# Altium schematic sheet DRV8323.SchDoc
size A4
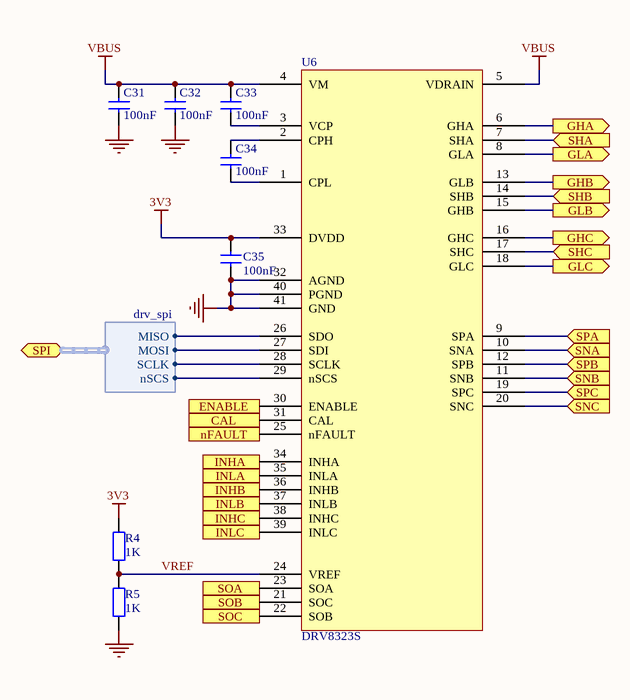
[diagram p0: DRV8323.SchDoc]

## Parts
C31  100nF  [CAP0402(1005)_N]
C32  100nF  [CAP0402(1005)_N]
C33  100nF  [CAP0402(1005)_N]
C34  100nF  [CAP0402(1005)_N]
C35  100nF  [CAP0402(1005)_N]
R4  1K  [RESC0402(1005)_N]
R5  1K  [RESC0402(1005)_N]
U6  DRV8323S  [WQFN-40]

## Ports
CAL (in), ENABLE (in), GHA (out), GHB (out), GHC (out), GLA (out), GLB (out), GLC (out), INHA (in), INHB (in), INHC (in), INLA (in), INLB (in), INLC (in), nFAULT (out), SHA (in), SHB (in), SHC (in), SNA (in), SNB (in), SNC (in), SOA (out), SOB (out), SOC (out), SPA (in), SPB (in), SPC (in), SPI (bidir, harness drv_spi)

## Harnesses
drv_spi: MISO, MOSI, SCLK, nSCS

## Nets
3V3: C35.2 R4.2 U6.33(DVDD)
GND: C31.1 C32.1 C35.1 R5.1 U6.32(AGND) U6.40(PGND) U6.41(GND)
VBUS: C31.2 C32.2 C33.2 U6.4(VM) U6.5(VDRAIN)
CAL: U6.31(CAL) ; port CAL
ENABLE: U6.30(ENABLE) ; port ENABLE
GHA: U6.6(GHA) ; port GHA
GHB: U6.13(GLB) ; port GHB
GHC: U6.16(GHC) ; port GHC
GLA: U6.8(GLA) ; port GLA
GLB: U6.15(GHB) ; port GLB
GLC: U6.18(GLC) ; port GLC
INHA: U6.34(INHA) ; port INHA
INHB: U6.36(INHB) ; port INHB
INHC: U6.38(INHC) ; port INHC
INLA: U6.35(INLA) ; port INLA
INLB: U6.37(INLB) ; port INLB
INLC: U6.39(INLC) ; port INLC
nFAULT: U6.25(nFAULT) ; port nFAULT
SHA: U6.7(SHA) ; port SHA
SHB: U6.14(SHB) ; port SHB
SHC: U6.17(SHC) ; port SHC
SNA: U6.10(SNA) ; port SNA
SNB: U6.11(SNB) ; port SNB
SNC: U6.20(SNC) ; port SNC
SOA: U6.23(SOA) ; port SOA
SOB: U6.21(SOC) ; port SOB
SOC: U6.22(SOB) ; port SOC
SPA: U6.9(SPA) ; port SPA
SPB: U6.12(SPB) ; port SPB
SPC: U6.19(SPC) ; port SPC
VREF: R4.1 R5.2 U6.24(VREF)
NetC33_1: C33.1 U6.3(VCP)
NetC34_1: C34.1 U6.1(CPL)
NetC34_2: C34.2 U6.2(CPH)
NetU6_26: U6.26(SDO) ; port SPI.MISO
NetU6_27: U6.27(SDI) ; port SPI.MOSI
NetU6_28: U6.28(SCLK) ; port SPI.SCLK
NetU6_29: U6.29(nSCS) ; port SPI.nSCS

## Library data of the parts
C31-C35 = cap_generic: Capacitor; Part: cap_generic; PartValue: 100nF; Mounting Technology: Surface Mount
R4 R5 = res_generic: Resistor; PartNumber: *; Manufacturer: *; Mounting Technology: Surface Mount; Digikey Part Number: *; Part: res_generic; PartValue: 1K
U6 = DRV8323S: Manufacturer: Texas Instruments; Part: DRV8323S; ComponentLink1URL: http://www.ti.com/lit/ds/symlink/drv8323.pdf